# Altium schematic sheet CarGeoLogger.SchDoc
size C; SheetNumber: 1; SheetTotal: 1
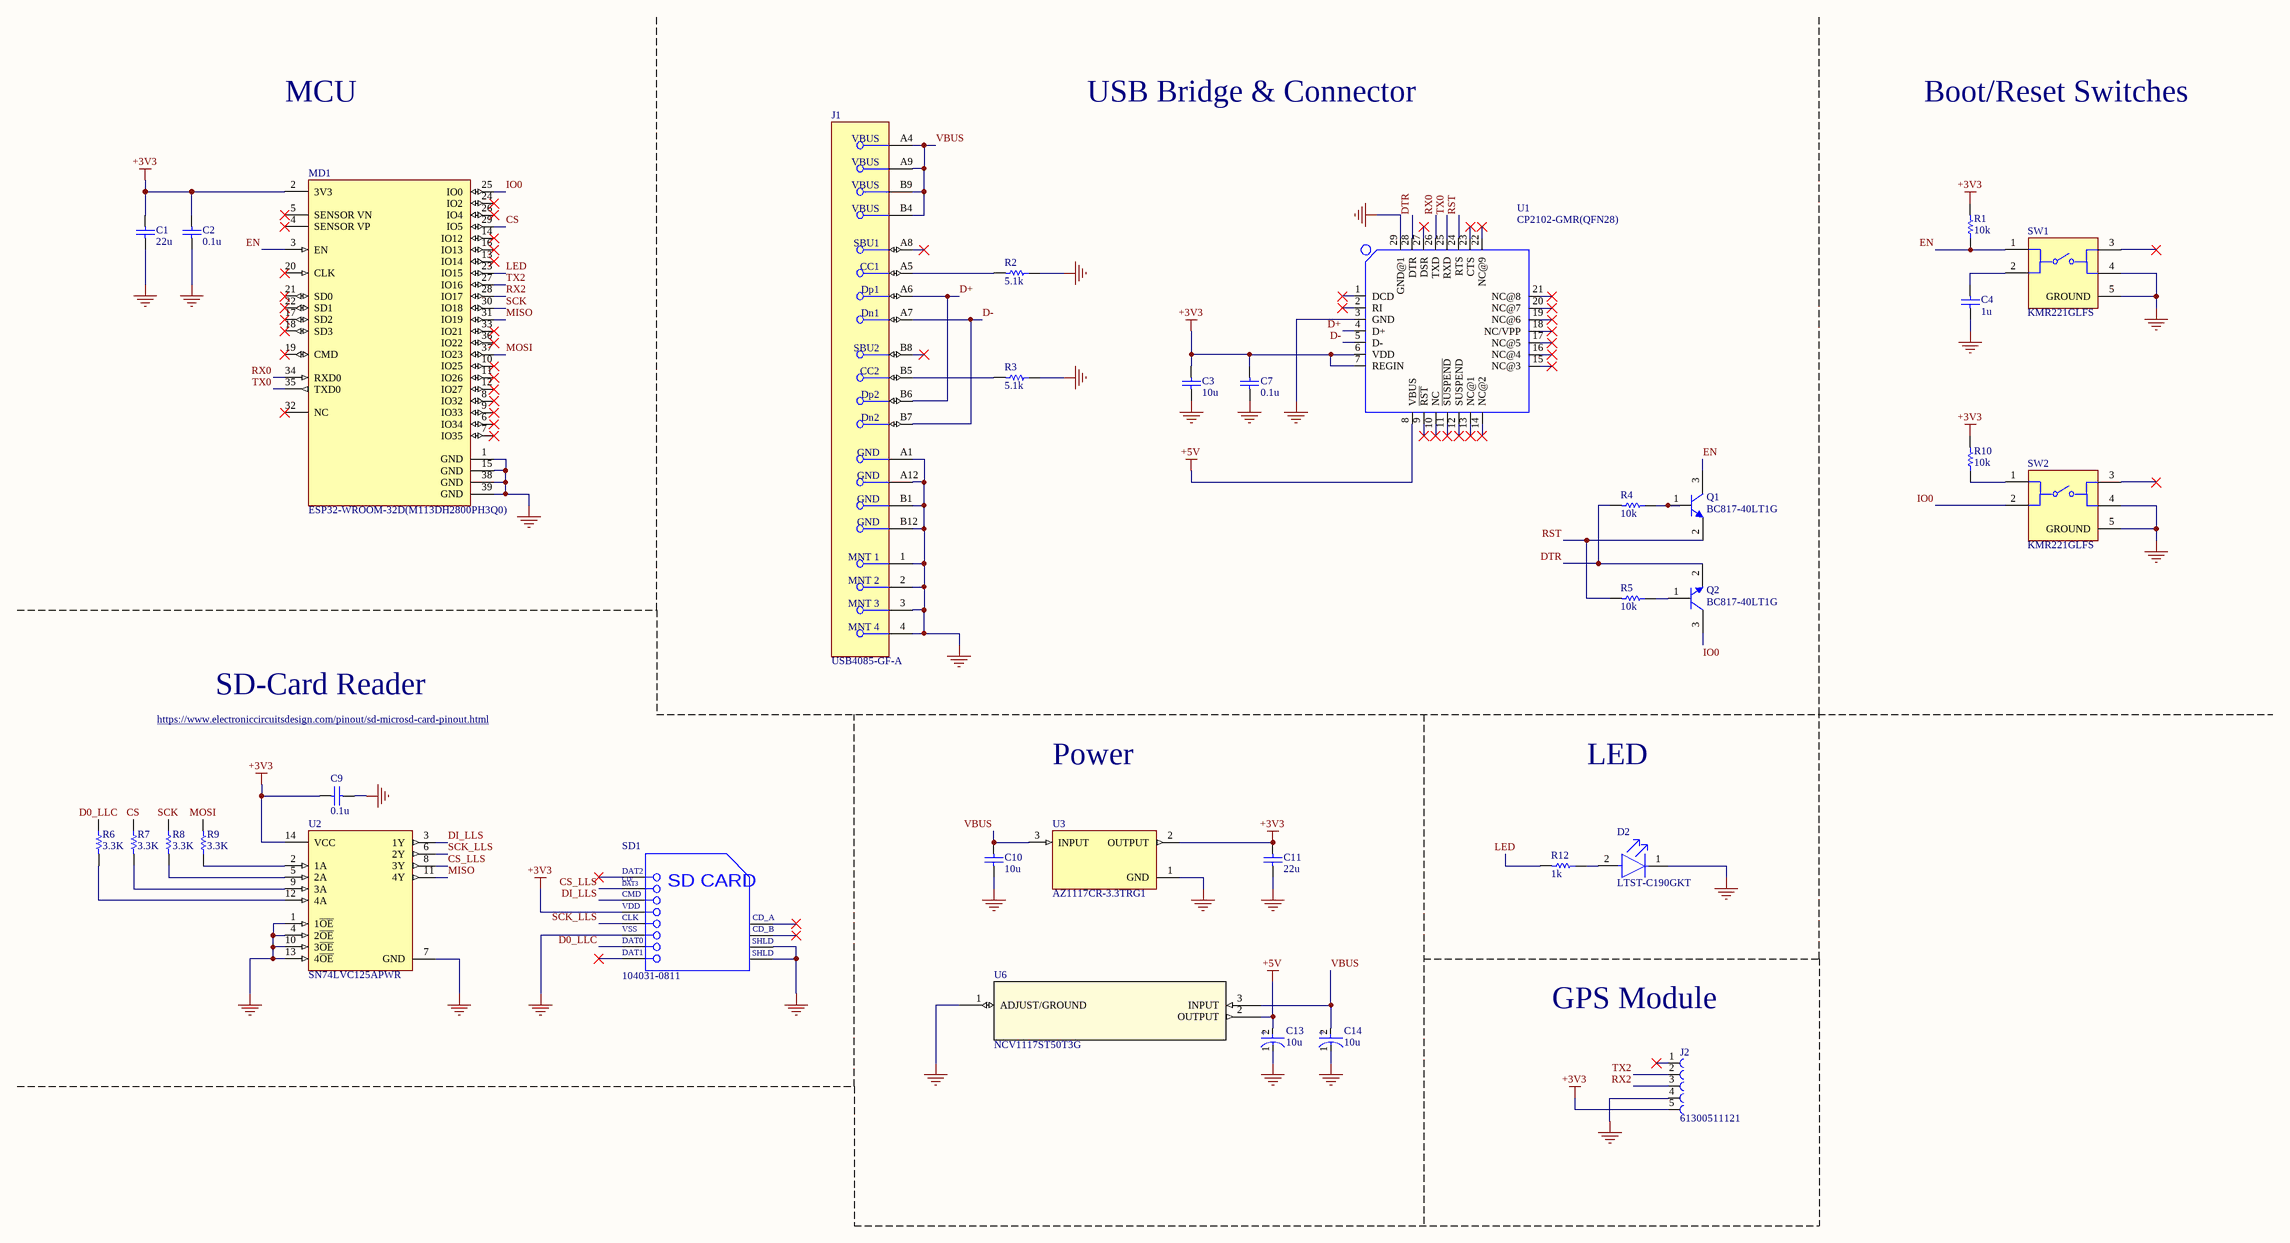
[diagram p0: CarGeoLogger.SchDoc]

## Parts
C1  22u  [CAPC1608X90X35ML10T15]
C2  0.1u  [CAPC1608X90X35ML10T15]
C3  10u  [CAPC1608X90X35ML10T15]
C4  1u  [CAPC1608X90X35ML10T15]
C7  0.1u  [CAPC1608X90X35ML10T15]
C9  0.1u  [CAPC1608X90X35ML10T15]
C10  10u  [CAPC1608X90X35ML10T15]
C11  22u  [CAPC1608X90X35ML10T15]
C13  10u  [FP-F38M-MFG]
C14  10u  [FP-F38M-MFG]
D2  LTST-C190GKT  [FP-LTST-C190GKT-MFG]
J1  USB4085-GF-A  [FP-USB4085-GF-A-MFG]
J2  61300511121  [61300511121]
MD1  ESP32-WROOM-32D(M113DH2800PH3Q0)  [FP-ESP32-WROOM-32D_M113DH-MFG]
Q1  BC817-40LT1G  [ONSC-SOT-23-3-318-08_V]
Q2  BC817-40LT1G  [ONSC-SOT-23-3-318-08_V]
R1  10k  [RESC1609X50X30NL8T20]
R2  5.1k  [RESC1609X50X30NL8T20]
R3  5.1k  [RESC1609X50X30NL8T20]
R4  10k  [RESC1609X50X30NL8T20]
R5  10k  [RESC1609X50X30NL8T20]
R6  3.3K  [RESC1609X50X30NL8T20]
R7  3.3K  [RESC1609X50X30NL8T20]
R8  3.3K  [RESC1609X50X30NL8T20]
R9  3.3K  [RESC1609X50X30NL8T20]
R10  10k  [RESC1609X50X30NL8T20]
R12  1k  [RESC1609X50X30NL8T20]
SD1  104031-0811  [MOLX-104031-0811_V]
SW1  KMR221GLFS  [FP-KMR221GLFS-MFG]
SW2  KMR221GLFS  [FP-KMR221GLFS-MFG]
U1  CP2102-GMR(QFN28)  [QFN28G_0.5-5X5MM]
U2  SN74LVC125APWR  [FP-PW0014A-IPC_B]
U3  AZ1117CR-3.3TRG1  [FP-SOT89-MFG]
U6  NCV1117ST50T3G  [SOT223-3_ONS]

## Nets
+3V3: C1.2 C2.2 C3.2 C7.2 C9.2 C11.2 J2.5 MD1.2(3V3) R1.2 R10.2 SD1.4(VDD) U1.6(VDD) U1.7(REGIN) U2.14(VCC) U3.2(OUTPUT)
+5V: C13.2(A) U1.8(VBUS) U6.2(OUTPUT)
NetC1_1: C1.1 C2.1 C3.1 C4.1 C7.1 C9.1 C10.1 C11.1 C13.1(C) C14.1(C) D2.1(C) J1.1(MNT_1) J1.2(MNT_2) J1.3(MNT_3) J1.4(MNT_4) J1.A1(GND) J1.A12(GND) J1.B1(GND) J1.B12(GND) J2.4 MD1.1(GND) MD1.15(GND) MD1.38(GND) MD1.39(GND) R2.1 R3.1 SD1.6(VSS2) SD1.11(SHLD1) SD1.12(SHLD2) SW1.4 SW1.5(GROUND) SW2.4 SW2.5(GROUND) U1.3(GND) U1.29(GND@1) U2.1(1~{OE}) U2.4(2~{OE}) U2.7(GND) U2.10(3~{OE}) U2.13(4~{OE}) U3.1(GND) U6.1(ADJUST/GROUND)
CS: MD1.29(IO5) R7.1
CS_LLS: SD1.2(CMD) U2.8(3Y)
D0_LLC: R6.1 SD1.7(DAT0)
D+: J1.A6(Dp1) J1.B6(Dp2) U1.4(D+)
D-: J1.A7(Dn1) J1.B7(Dn2) U1.5(D-)
DI_LLS: SD1.3(VSS1) U2.3(1Y)
DTR: Q2.2(E) R4.2 U1.28(DTR)
EN: MD1.3(EN) Q1.3(C) R1.1 SW1.1
IO0: MD1.25(IO0) Q2.3(C) SW2.2
LED: MD1.23(IO15) R12.2
MISO: MD1.31(IO19) U2.11(4Y)
MOSI: MD1.37(IO23) R9.2
RST: Q1.2(E) R5.2 U1.24(RTS)
RX0: MD1.34(RXD0) U1.26(TXD)
RX2: J2.3 MD1.28(IO17)
SCK: MD1.30(IO18) R8.1
SCK_LLS: SD1.5(CLK) U2.6(2Y)
TX0: MD1.35(TXD0) U1.25(RXD)
TX2: J2.2 MD1.27(IO16)
VBUS: C10.2 C14.2(A) J1.A4(VBUS) J1.A9(VBUS) J1.B4(VBUS) J1.B9(VBUS) U3.3(INPUT) U6.3(INPUT)
NetC4_2: C4.2 SW1.2
NetD2_2: D2.2(A) R12.1
NetJ1_A5: J1.A5(CC1) R2.2
NetJ1_B5: J1.B5(CC2) R3.2
NetQ1_1: Q1.1(B) R4.1
NetQ2_1: Q2.1(B) R5.1
NetR6_2: R6.2 U2.12(4A)
NetR7_2: R7.2 U2.9(3A)
NetR8_2: R8.2 U2.5(2A)
NetR9_1: R9.1 U2.2(1A)
NetR10_1: R10.1 SW2.1

Not connected (* = marked no-connect by the designer): J1 A8(SBU1)* B8(SBU2)*; J2 1*; MD1 4(SENSOR_VP)* 5(SENSOR_VN)* 6(IO34)* 7(IO35)* 8(IO32)* 9(IO33)* 10(IO25)* 11(IO26)* 12(IO27)* 13(IO14)* 14(IO12)* 16(IO13)* 17(SD2)* 18(SD3)* 19(CMD)* 20(CLK)* 21(SD0)* 22(SD1)* 24(IO2)* 26(IO4)* 32(NC)* 33(IO21)* 36(IO22)*; SD1 1(CD/DAT3)* 8(DAT1)* 9(CD_A)* 10(CD_B)*; SW1 3*; SW2 3*; U1 1(DCD)* 2(RI)* 9(~{RST})* 10(NC)* 11(~{SUSPEND})* 12(SUSPEND)* 13(NC@1)* 14(NC@2)* 15(NC@3)* 16(NC@4)* 17(NC@5)* 18(NC/VPP)* 19(NC@6)* 20(NC@7)* 21(NC@8)* 22(NC@9)* 23(CTS)* 27(DSR)*

## Notes on the sheet
- MCU
- USB Bridge & Connector
- Boot/Reset Switches
- SD-Card Reader
- https://www.electroniccircuitsdesign.com/pinout/sd-microsd-card-pinout.html
- Power
- LED
- GPS Module
- (in symbol CMP-2000-05825-1) DAT2; CD/; DAT3; SD CARD; VSS; SHLD
- (in symbol CMP-04423-000015-1) +

## Library data of the parts
C1 C11 = CMP-2000-04945-1: Chip Capacitor, 0603 (1608 Metric), F381A106MMAAH1; Manufacturer: Murata; Capacitance: 22pF; Tolerance (%): ±5%; Rated Voltage: 50V; Dielectric: C0G; Manufacturer URL: http://www.murata.com/; Datasheet Version: Jul-06; Package Reference: 603; Case Size/Dimension: 0603; Package Description: 2-Pin Surface Mount Device, Body 1.6 x 0.8 mm; Datasheet URL: https://datasheet.ciiva.com/11786/0900766b807a1cab-11786398.pdf; ComponentLink1Description: https://www.digikey.com/en/products/detail/kyocera-avx/F381A106MMAAH1/5730801; ComponentLink1URL: *
C2-C4 C7 C9 C10 = CMP-2000-04945-1: Chip Capacitor, 0603 (1608 Metric); Manufacturer: Murata; Capacitance: 22pF; Tolerance (%): ±5%; Rated Voltage: 50V; Dielectric: C0G; Manufacturer URL: http://www.murata.com/; Datasheet Version: Jul-06; Package Reference: 603; Case Size/Dimension: 0603; Package Description: 2-Pin Surface Mount Device, Body 1.6 x 0.8 mm; Datasheet URL: https://datasheet.ciiva.com/11786/0900766b807a1cab-11786398.pdf
C13 C14 = CMP-04423-000015-1: CAP TANT POLY 10UF 10V SMD; Manufacturer Part Number: F381A106MMAAH1; Manufacturer: AVX; Material: Tantalum-Polymer; Life: 1000Hours; Ripple Current: 289mA; Leakage Current: 10uA; Dissipation Factor: 15%; Esr: 300mΩ; Tolerance: 20%; Category: Cap; ComponentLink2URL: http://datasheets.avx.com/F38.pdf; Automotive: No; Package: F38M; Device Class L2: Capacitors; Octopart: https://octopart.com/f381a106mmaah1-avx-67040376; Device Class L1: Passive Components; Lead Free: Yes; Temperature Range High: +105°C; ComponentLink2Description: Datasheet; Digikey Description: CAP TANT POLY 10UF 10V SMD; Value: 10uF; Temperature Range Low: -55°C; Temperature: -55°C to +105°C; Device Class L3: Polymer Capacitors; Capacitance: 10uF; Height: 0.9mm; Footprint Url: http://www.avx.com/download/software/literature/AVX-Footprint-Library.pdf; RoHS: TRUE; Voltage Rating: 10V; Mouser Description: Cap Tant Polymer 10uF 10VDC M CASE 20% (1.6 X 0.85 X 0.8mm) Undertab SMD 1608-09 0.3 Ohm 105C T/R
D2 = CMP-22017-000005-2: LED GREEN CLEAR CHIP SMD; Dominant Wavelength: 569nm; Reverse Voltage: 5V; Lens Color: Colorless; Viewing Angle: 130°; Voltage: 2V; Forward Current: 30mA; Power Dissipation: 100mW; Luminous Intensity: 6mcd; Number of LEDs: 1; Forward Voltage: 2.1V; Wavelength: 565nm; Test Current: 10mA; Min Operating Temperature: -55°C; Lens Style: Clear; Mount: Surface Mount; Width: 0.8mm; Packaging: Tape and Reel; Lens Transparency: Clear; Case Code (Metric): 1608; Depth: 0.8mm; Case Code (Imperial): 0603; Case/Package: 0603; Number of Pins: 2; Max Operating Temperature: 85°C; Lead Free: Lead Free; Number of Elements: 1; Length: 1.6mm; Height: 0.8mm; Package Quantity: 1; Power Rating: 100mW; Radiation Hardening: No; Illumination Color: Green; Color: Green
J1 = CMP-196119-000001-2: CONN RCPT USB2.0 TYPE C 24POS RA; Gender: Receptacle; Number of Positions: 16; USB Standard: USB 2.0; Orientation: Right Angle; Contact Plating: Gold; Contact Material: Copper Alloy; ComponentLink1Description: https://www.digikey.com/en/products/detail/gct/USB4085-GF-A/9859662; ComponentLink1URL: *
J2 = CMP-059-000000-1: Connector Header Through Hole 5 position 0.100 (2.54mm); MF: Wurth Electronics; Design Item ID: 61300511121; Price: None; SnapEDA_Link: https://www.snapeda.com/parts/61300511121/Wurth+Electronics+Inc./view-part/?ref=snap; Source: 61300511121.SchLib; Check_prices: https://www.snapeda.com/parts/61300511121/Wurth+Electronics+Inc./view-part/?ref=eda; Package: None; MP: 61300511121; Availability: In Stock; Component Type: Standard; Value: *; Pin Count: 5; Purchase-URL: https://pricing.snapeda.com/search/part/61300511121/?ref=eda
MD1 = CMP-194065-000024-1: RX TXRX MOD WIFI TRACE ANT SMD
Q1 Q2 = CMP-1048-00019-1: General Purpose Transistor, NPN Silicon, 3-Pin SOT-23, Pb-Free, Tape and Reel; Manufacturer: On Semiconductor; fT Min (MHz): 100; IC Continuous (A): 0.5; ComponentLink2URL: http://www.onsemi.com/pub_link/Collateral/BC817-16LT1-D.PDF; DatasheetVersion: Rev. 12; ComponentLink3URL: http://www.onsemi.cn/pub_link/Collateral/318-08.PDF; ComponentLink3Description: Package Specification; ComponentLink1Description: Manufacturer URL; Mounting Technology: Surface Mount; ComponentLink1URL: http://www.onsemi.com/; Packing: Tape and Reel; ComponentLink2Description: Datasheet; Polarity: NPN; RoHS: TRUE; PackageVersion: Rev. AP, 11/2009; PartNumber: BC817-40LT1G; PackageDescription: 3-Pin Small Outline Transistor, Body 2.92 x 1.3 mm, Pitch 0.95 mm; PackageReference: SOT-23-3-318-08
R1-R10 R12 = CMP-2000-03816-5: Chip Resistor, 0603 (1608 Metric); Manufacturer: Vishay Semiconductor; Voltage Rating: 75 V; Package Quantity: 5000; DatasheetVersion: 06/2012; Min Operating Temperature: -55 degC; ComponentLink1URL: http://www.vishay.com/; Mounting Technology: Surface Mount; Height: 0.45 mm; ComponentLink1Description: Manufacturer URL; REACH SVHC: Unknown; PackageReference: 0603; Packaging: Tape and Reel; Max Operating Temperature: 155 degC; Mount: Surface Mount; ComponentLink2Description: Datasheet; PackageDescription: 2-Pin Surface Mount Device, Body 1.575 x 0.85 mm; Length: 1.55 mm; ComponentLink2URL: http://www.vishay.com/docs/20035/dcrcwe3.pdf; Pins: 2; RoHSCompliant: true
SD1 = CMP-2000-05825-1: Micro SD Card, RA, -25 to 85 degC, 8-Pin SMD, RoHS, Tape and Reel; Voltage Rating: 10VAC/DC; Number of Contacts: 8; Insertion - Extraction Style: Push-Pull; Pitch: 1.1mm; Mating Cycles: 10000; Brand: Molex; Current Rating: 500mA; Manufacturer URL: http://www.molex.com/; Card Type: microSD; Mounting Type: Standard; Height: 1.42mm; Mounting Technology: SurfaceMount; Contact Plating: Gold; Product Category: MemoryCardConnectors; Package Description: 8-Pin Surface Mount Device, Body 11.95 x 11.4 mm, Pitch 1.1 mm; Datasheet URL: http://www.molex.com/pdm_docs/sd/1040310811_sd.pdf; Termination Style: SMD; Length: 11.4mm; Housing Material: LiquidCrystalPolymer(LCP); Orientation: RightAngle; RoHS: True; Contact Material: PhosphorBronze; Datasheet Version: Rev. E, 04/2006; Packaging: Reel; Manufacturer: Molex; Series: 104031; Product: CardConnectors; Number of Rows: 1Row; Package Reference: 104031-0811; ComponentLink1Description: https://www.digikey.com/en/products/detail/molex/1040310811/2804769?utm_adgroup=Memory%20Connectors%20-%20PC%20Card%20Sockets&utm_source=google&utm_medium=cpc&utm_campaign=Shopping_Product_Connectors%2C%20Interconnects_NEW&utm_term=&utm_content=Memory%20Connectors%20-%20PC%20Card%20Sockets&gclid=Cj0KCQiAkMGcBhCSARIsAIW6d0B1XDvVP_Lj4c3XwzfmNxsc3S9UzxOJEQPBbiR74h_ZBigbZJJcNlIaAqCzEALw_wcB; ComponentLink1URL: *
SW1 SW2 = CMP-10040-000018-1: SWITCH TACTILE SPST-NO 0.05A 32V; Illumination Type: Non-Illuminated; Contact Resistance: 100mR; Power Rating: 1W; Actuator Type: Standard; Operating Force: 2N; Max Current Rating: 50mA; Switch Function: Off-Mom; Switch Travel: 0.25mm; Actuator Length: 0.5mm; Mechanical Life: 200000Cycles; Throw Configuration: SPST; Length: 2.8mm; Max Voltage Rating (DC): 32V; Depth: 4.6mm; Orientation: Straight; Max Operating Temperature: 85°C; Packaging: Tape and Reel; Voltage Rating (DC): 32V; Width: 2.8mm; Termination: Gull Wing; Contact Plating: Silver; Case/Package: SMD/SMT; Contact Current Rating: 50mA; Mount: Surface Mount; Current Rating: 50mA; REACH SVHC: No SVHC; Lead Free: Lead Free; Radiation Hardening: No; Package Quantity: 1; Contact Material: Silver; Min Operating Temperature: -40°C
U1 = CMP-037-000000-1: USB Bridge, USB to UART USB 2.0 UART Interface 28-QFN _5x5_; MF: Silicon; MP: CP2102-GMR; Price: None; Component Type: Standard; Design Item ID: INTERFACE-CP2102-GMR(QFN28); Value: *; Availability: Unavailable; Package: VFQFN-28 Vishay Siliconix; Pin Count: 29; SnapEDA_Link: https://www.snapeda.com/parts/CP2102-GMR/Silicon%20Labs/view-part/570818/?ref=snap; Source: SnapEDAsch.SchLib; ComponentLink1Description: https://www.digikey.com/en/products/detail/silicon-labs/CP2102-GMR/2051863; ComponentLink1URL: *
U2 = CMP-0440-00179-4: IC BUF NON-INVERT 3.6V 14TSSOP; Max Power Dissipation: 500mW; Number of Bits per Element: 1; Number of Bits: 4; Quiescent Current: 1uA; Min Supply Voltage: 1.65V; Propagation Delay: 4.6ns; High Level Output Current: -24mA; Logic Function: Buffer; Low Level Output Current: 24mA; Polarity: Non-Inverting; Turn-On Delay Time: 5.3ns; Number of Output Lines: 3; Mount: Surface Mount; Lead Free: Lead Free; Number of Outputs: 4; Max Supply Voltage: 3.6V; Packaging: Tape and Reel; Radiation Hardening: No; Number of Channels: 4; REACH SVHC: No SVHC; Length: 5mm; Number of Elements: 4; Contact Plating: Gold; Case/Package: TSSOP; Number of Input Lines: 4; Number of Inputs: 4; Height: 1.15mm; Number of Circuits: 4; Termination: SMD/SMT; Min Operating Temperature: -40°C; Package Quantity: 1; Number of Gates: 4; Max Operating Temperature: 125°C; Width: 4.4mm; Number of Pins: 14
U3 = CMP-12756-000007-1: IC REG LINEAR 3.3V 800MA SOT89; Manufacturer: Diodes Inc.; Nominal Supply Current: 4mA; Output Type: Fixed; Accuracy Percentage: 1%; Max Junction Temp: +125°C; Max Supply Voltage: 15V; Number Of Outputs: 1; Output Current: 1.35A; Dropout Voltage: 1.2V; Device Class L1: Integrated Circuits (ICs); ComponentLink2URL: https://www.diodes.com/assets/Datasheets/AZ1117C.pdf; Temperature Range High: +125°C; Octopart: https://octopart.com/az1117cr-3.3trg1-diodes+inc.-30954805; Output Voltage: 3.3V; Automotive: No; RoHS: TRUE; Temperature Range Low: -20°C; Package: SOT89; Height: 1.6mm; Mouser Description: DiodesZetex AZ1117CR-3.3TRG1, LDO Regulator, 800mA, 3.3 V, ±1% 3-Pin, SOT-89; Manufacturer Part Number: AZ1117CR-3.3TRG1; ComponentLink2Description: Datasheet; Device Class L2: Power Management ICs; Lead Free: Yes; Device Class L3: Voltage Regulators - Linear; Category: IC; Temperature: -20°C to +125°C; Footprint Url: https://www.diodes.com/assets/Package-Files/SOT89.pdf; Digikey Description: IC REG LINEAR 3.3V 800MA SOT89
U6 = CMP-053-000001-1: No Description Available; Mfr_Name: onsemi; Type: DEV; Manufacturer_Part_Number: NCV1117ST50T3G; Source: NCV1117ST50T3G.SchLib; Copyright: Copyright (C) 2022 Ultra Librarian. All rights reserved.; Digi-Key_Part_Number_4: 2156-NCV1117ST50T3G-OS-ND; Digi-Key_Part_Number_3: NCV1117ST50T3GOSTR-ND; Design Item ID: NCV1117ST50T3G; Digi-Key_Part_Number_2: NCV1117ST50T3GOSDKR-ND; Digi-Key_Part_Number_1: NCV1117ST50T3GOSCT-ND; RefDes: RefDes; ComponentLink1Description: https://www.digikey.com/en/products/detail/onsemi/NCV1117ST50T3G/1792666; ComponentLink1URL: *